# Altium schematic sheet motordriver-v5.0_inductors.SchDoc
size A4; SheetNumber: 7; SheetTotal: 10
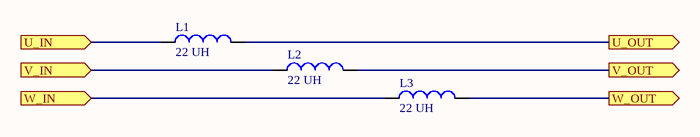
[diagram p0: motordriver-v5.0_inductors.SchDoc]

## Parts
L1  22 UH  [EATON _HCM1A1307V2-220-R]
L2  22 UH  [EATON _HCM1A1307V2-220-R]
L3  22 UH  [EATON _HCM1A1307V2-220-R]

## Ports
U_IN (in), U_OUT (out), V_IN (in), V_OUT (out), W_IN (in), W_OUT (out)

## Nets
U_IN: L1.1 ; port U_IN
U_OUT: L1.2 ; port U_OUT
V_IN: L2.1 ; port V_IN
V_OUT: L2.2 ; port V_OUT
W_IN: L3.1 ; port W_IN
W_OUT: L3.2 ; port W_OUT

## Library data of the parts
L1-L3 = IND 22UH 6A 33.1 mOHM SMD: Automotive Grade High Current Power Inductor 22uH 6A 28.8mOhm 5MHz SRF 2-Pin Surface Mount T/R; Manufacturer Part Number: HCM1A1307V2-220-R; Supplier 1: Digi-Key; Supplier Part Number 1: 283-HCM1A1307V2-220-RCT-ND; Part Number: IND 22UH 6A 33.1 mOHM SMD; Supplier URL 1: https://www.digikey.ca/en/products/detail/eaton-electronics-division/HCM1A1307V2-220-R/10479205?s=N4IgTCBcDa4BwGYC0AJAwgWQIwEEsIAYB2ANTCTDAKQCU0AVJAOQBEQBdAXyA; Value: 22 uH